# Altium schematic sheet Batarang.SchDoc
size 292 x 193 mm; Author: Power Lin; Revision: 2.0B; SheetNumber: 1; SheetTotal: 4; Website: wiki-power.com
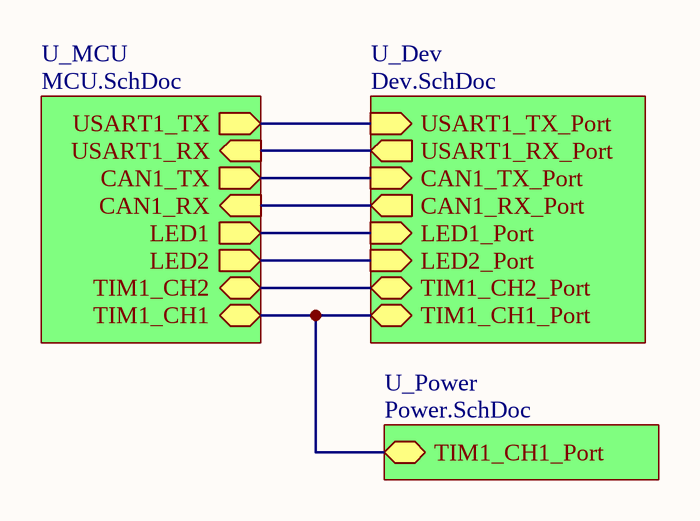
[diagram p0: Batarang.SchDoc]

## Sub-sheets
U_Dev = Dev.SchDoc: CAN1_RX_Port (out), CAN1_TX_Port (in), LED1_Port (in), LED2_Port (in), USART1_TX_Port (in), USART1_RX_Port (out), TIM1_CH1_Port (bidir), TIM1_CH2_Port (bidir)
U_MCU = MCU.SchDoc: USART1_TX (out), USART1_RX (in), CAN1_RX (in), CAN1_TX (out), TIM1_CH1 (bidir), TIM1_CH2 (bidir), LED1 (out), LED2 (out)
U_Power = Power.SchDoc: TIM1_CH1_Port (bidir)

## Nets
(unnamed): sheet U_MCU/USART1_TX, sheet U_Dev/USART1_TX_Port
(unnamed): sheet U_MCU/USART1_RX, sheet U_Dev/USART1_RX_Port
(unnamed): sheet U_MCU/CAN1_RX, sheet U_Dev/CAN1_RX_Port
(unnamed): sheet U_MCU/CAN1_TX, sheet U_Dev/CAN1_TX_Port
(unnamed): sheet U_MCU/TIM1_CH1, sheet U_Dev/TIM1_CH1_Port, sheet U_Power/TIM1_CH1_Port
(unnamed): sheet U_MCU/TIM1_CH2, sheet U_Dev/TIM1_CH2_Port
(unnamed): sheet U_MCU/LED1, sheet U_Dev/LED1_Port
(unnamed): sheet U_MCU/LED2, sheet U_Dev/LED2_Port

## Notes on the sheet
- Author
- DocumentName
- ModifiedDate
- ProjectName
- SheetNumber
- SheetTotal
- Website
- Revision